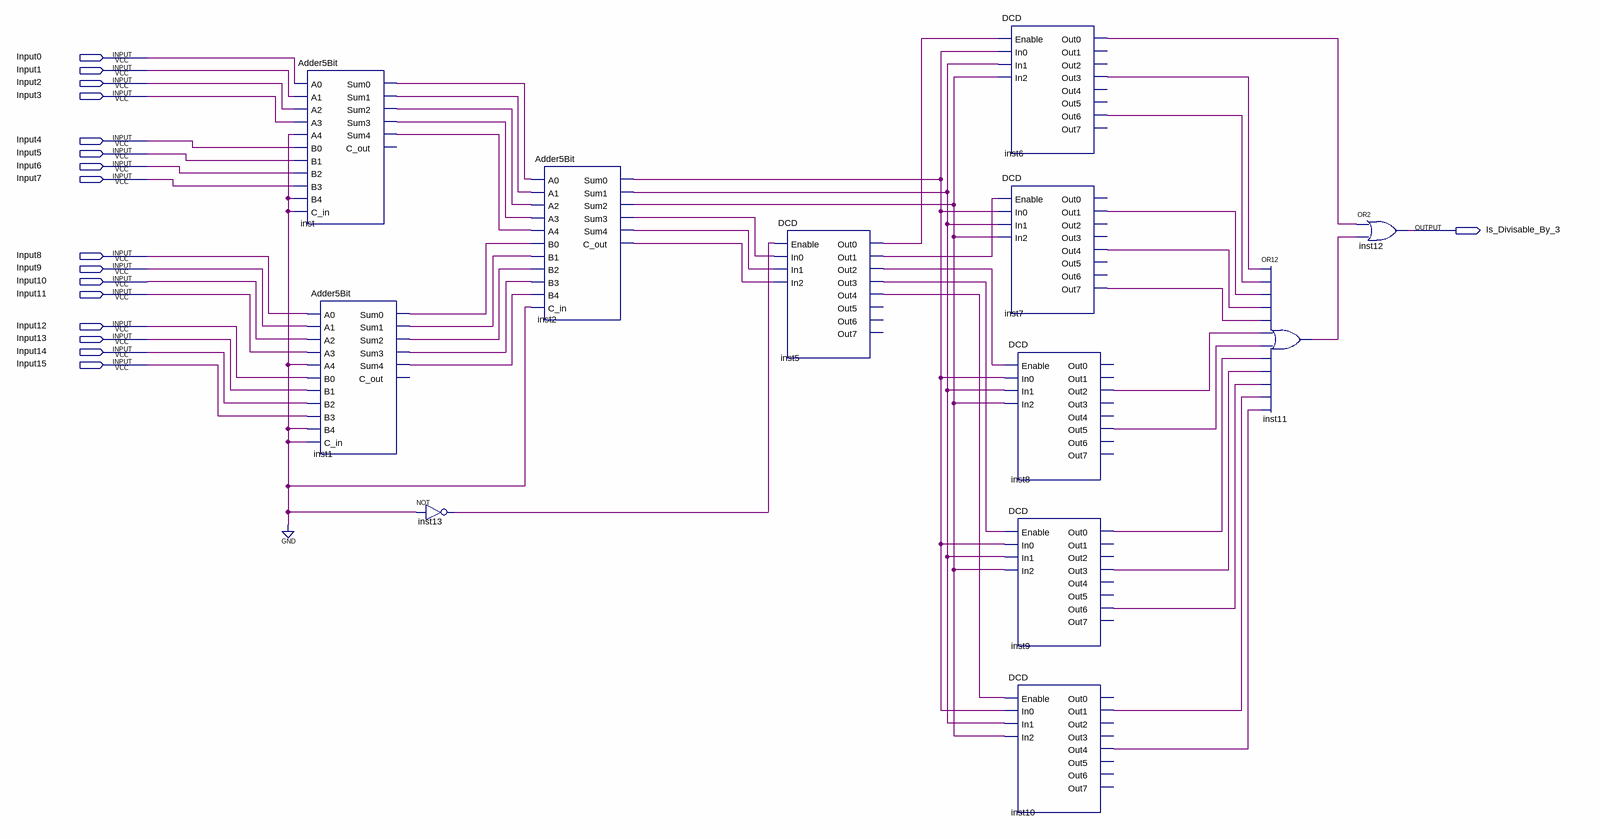
[diagram p0: schematic sheet]
// Quartus schematic DivisibilityBy3.bdf as structural Verilog: 12 symbols, 17 pins
module DivisibilityBy3 (
  input  Input0,
  input  Input1,
  input  Input2,
  input  Input3,
  input  Input4,
  input  Input5,
  input  Input6,
  input  Input7,
  input  Input8,
  input  Input9,
  input  Input10,
  input  Input11,
  input  Input12,
  input  Input13,
  input  Input14,
  input  Input15,
  output Is_Divisable_By_3
);

  wire inst1_sum0, inst1_sum1, inst1_sum2, inst1_sum3, inst1_sum4, inst2_c_out, inst2_sum0, inst2_sum1,
       inst2_sum2, inst2_sum3, inst2_sum4, inst5_out0, inst5_out1, inst5_out2, inst5_out3, inst5_out4,
       inst6_out0, inst6_out3, inst6_out6, inst7_out1, inst7_out4, inst7_out7, inst8_out2, inst8_out5,
       inst9_out0, inst9_out3, inst9_out6, inst10_out1, inst10_out4, inst11_out, inst13_out, inst_sum0,
       inst_sum1, inst_sum2, inst_sum3, inst_sum4;

  Adder5Bit inst (
    .A0(Input0), .A1(Input1), .A2(Input2), .A3(Input3), .A4(1'b0), .B0(Input4), .B1(Input5), .B2(Input6),
    .B3(Input7), .B4(1'b0), .C_in(1'b0), .Sum0(inst_sum0), .Sum1(inst_sum1), .Sum2(inst_sum2),
    .Sum3(inst_sum3), .Sum4(inst_sum4));  // open: C_out
  Adder5Bit inst1 (
    .A0(Input8), .A1(Input9), .A2(Input10), .A3(Input11), .A4(1'b0), .B0(Input12), .B1(Input13),
    .B2(Input14), .B3(Input15), .B4(1'b0), .C_in(1'b0), .Sum0(inst1_sum0), .Sum1(inst1_sum1),
    .Sum2(inst1_sum2), .Sum3(inst1_sum3), .Sum4(inst1_sum4));  // open: C_out
  not inst13 (inst13_out, 1'b0);
  Adder5Bit inst2 (
    .A0(inst_sum0), .A1(inst_sum1), .A2(inst_sum2), .A3(inst_sum3), .A4(inst_sum4), .B0(inst1_sum0),
    .B1(inst1_sum1), .B2(inst1_sum2), .B3(inst1_sum3), .B4(inst1_sum4), .C_in(1'b0), .Sum0(inst2_sum0),
    .Sum1(inst2_sum1), .Sum2(inst2_sum2), .Sum3(inst2_sum3), .Sum4(inst2_sum4), .C_out(inst2_c_out));
  DCD inst5 (
    .Enable(inst13_out), .In0(inst2_sum3), .In1(inst2_sum4), .In2(inst2_c_out), .Out0(inst5_out0),
    .Out1(inst5_out1), .Out2(inst5_out2), .Out3(inst5_out3), .Out4(inst5_out4));  // open: Out5, Out6, Out7
  DCD inst6 (
    .Enable(inst5_out0), .In0(inst2_sum0), .In1(inst2_sum1), .In2(inst2_sum2), .Out0(inst6_out0),
    .Out3(inst6_out3), .Out6(inst6_out6));  // open: Out1, Out2, Out4, Out5, Out7
  DCD inst7 (
    .Enable(inst5_out1), .In0(inst2_sum0), .In1(inst2_sum1), .In2(inst2_sum2), .Out1(inst7_out1),
    .Out4(inst7_out4), .Out7(inst7_out7));  // open: Out0, Out2, Out3, Out5, Out6
  DCD inst8 (
    .Enable(inst5_out2), .In0(inst2_sum0), .In1(inst2_sum1), .In2(inst2_sum2), .Out2(inst8_out2),
    .Out5(inst8_out5));  // open: Out0, Out1, Out3, Out4, Out6, Out7
  DCD inst9 (
    .Enable(inst5_out3), .In0(inst2_sum0), .In1(inst2_sum1), .In2(inst2_sum2), .Out0(inst9_out0),
    .Out3(inst9_out3), .Out6(inst9_out6));  // open: Out1, Out2, Out4, Out5, Out7
  DCD inst10 (
    .Enable(inst5_out4), .In0(inst2_sum0), .In1(inst2_sum1), .In2(inst2_sum2), .Out1(inst10_out1),
    .Out4(inst10_out4));  // open: Out0, Out2, Out3, Out5, Out6, Out7
  or inst11 (inst11_out, inst6_out3, inst6_out6, inst7_out1, inst7_out4, inst7_out7, inst8_out2, inst8_out5, inst9_out0, inst9_out3, inst9_out6, inst10_out1, inst10_out4);
  or inst12 (Is_Divisable_By_3, inst6_out0, inst11_out);
endmodule
